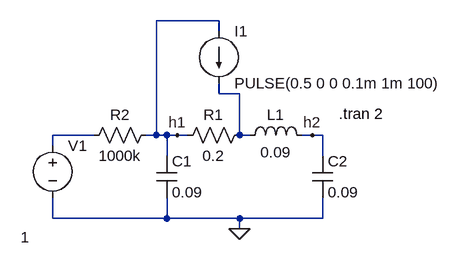
[diagram p0: schematic hydres.asc]
hydres.asc, the LTspice schematic file:
Version 4
SHEET 1 880 680
WIRE 112 -80 16 -80
WIRE 112 -64 112 -80
WIRE 112 32 112 16
WIRE 144 32 112 32
WIRE -80 96 -144 96
WIRE 16 96 16 -80
WIRE 16 96 0 96
WIRE 32 96 16 96
WIRE 48 96 32 96
WIRE 64 96 48 96
WIRE 144 96 144 32
WIRE 160 96 144 96
WIRE 256 96 240 96
WIRE 272 96 256 96
WIRE -144 112 -144 96
WIRE 32 128 32 96
WIRE 272 128 272 96
WIRE -144 224 -144 192
WIRE 32 224 32 192
WIRE 32 224 -144 224
WIRE 144 224 32 224
WIRE 272 224 272 192
WIRE 272 224 144 224
WIRE 144 240 144 224
FLAG 144 240 0
FLAG 48 96 h1
FLAG 256 96 h2
SYMBOL ind 144 112 R270
WINDOW 0 32 56 VTop 2
WINDOW 3 5 56 VBottom 2
SYMATTR InstName L1
SYMATTR Value 0.09
SYMBOL cap 16 128 R0
SYMATTR InstName C1
SYMATTR Value 0.09
SYMBOL cap 256 128 R0
SYMATTR InstName C2
SYMATTR Value 0.09
SYMBOL res 160 80 R90
WINDOW 0 0 56 VBottom 2
WINDOW 3 32 56 VTop 2
SYMATTR InstName R1
SYMATTR Value 0.2
SYMBOL res 16 80 R90
WINDOW 0 0 56 VBottom 2
WINDOW 3 32 56 VTop 2
SYMATTR InstName R2
SYMATTR Value 1000k
SYMBOL voltage -144 96 R0
WINDOW 3 -49 157 Left 2
WINDOW 123 0 0 Left 2
WINDOW 39 0 0 Left 2
SYMATTR InstName V1
SYMATTR Value 1
SYMBOL current 112 -64 R0
WINDOW 123 0 0 Left 2
WINDOW 39 0 0 Left 2
SYMATTR InstName I1
SYMATTR Value PULSE(0.5 0 0 0.1m 1m 100)
TEXT 297 63 Left 2 !.tran 2

The netlist it stands for:
* hydres.asc
L1 N001 h2 0.09
C1 h1 0 0.09
C2 h2 0 0.09
R1 N001 h1 0.2
R2 h1 N002 1000k
V1 N002 0 1
I1 h1 N001 PULSE(0.5 0 0 0.1m 1m 100)
.tran 2
.backanno
.end